# EAGLE board l3lfinal (EAGLE 6.5.0)
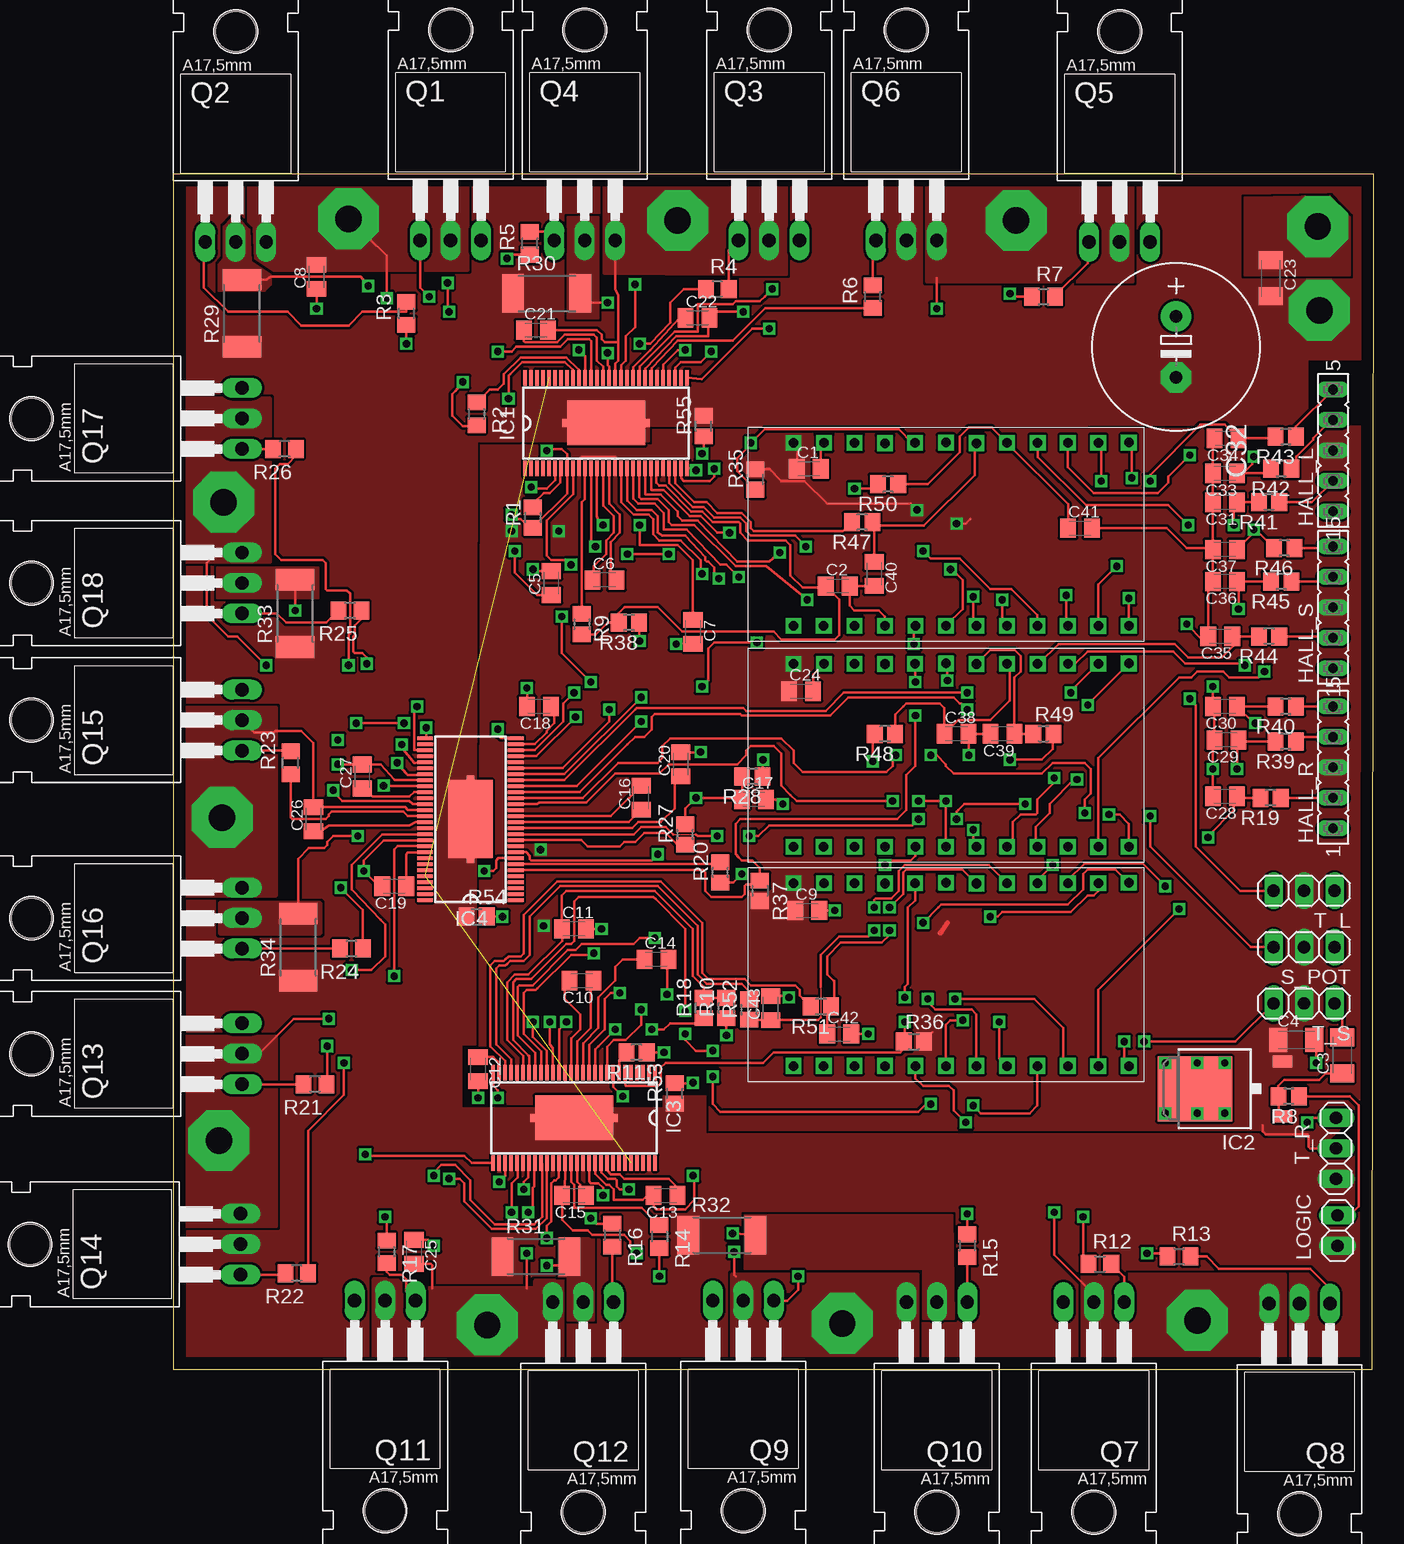
[diagram p3: board, top side]
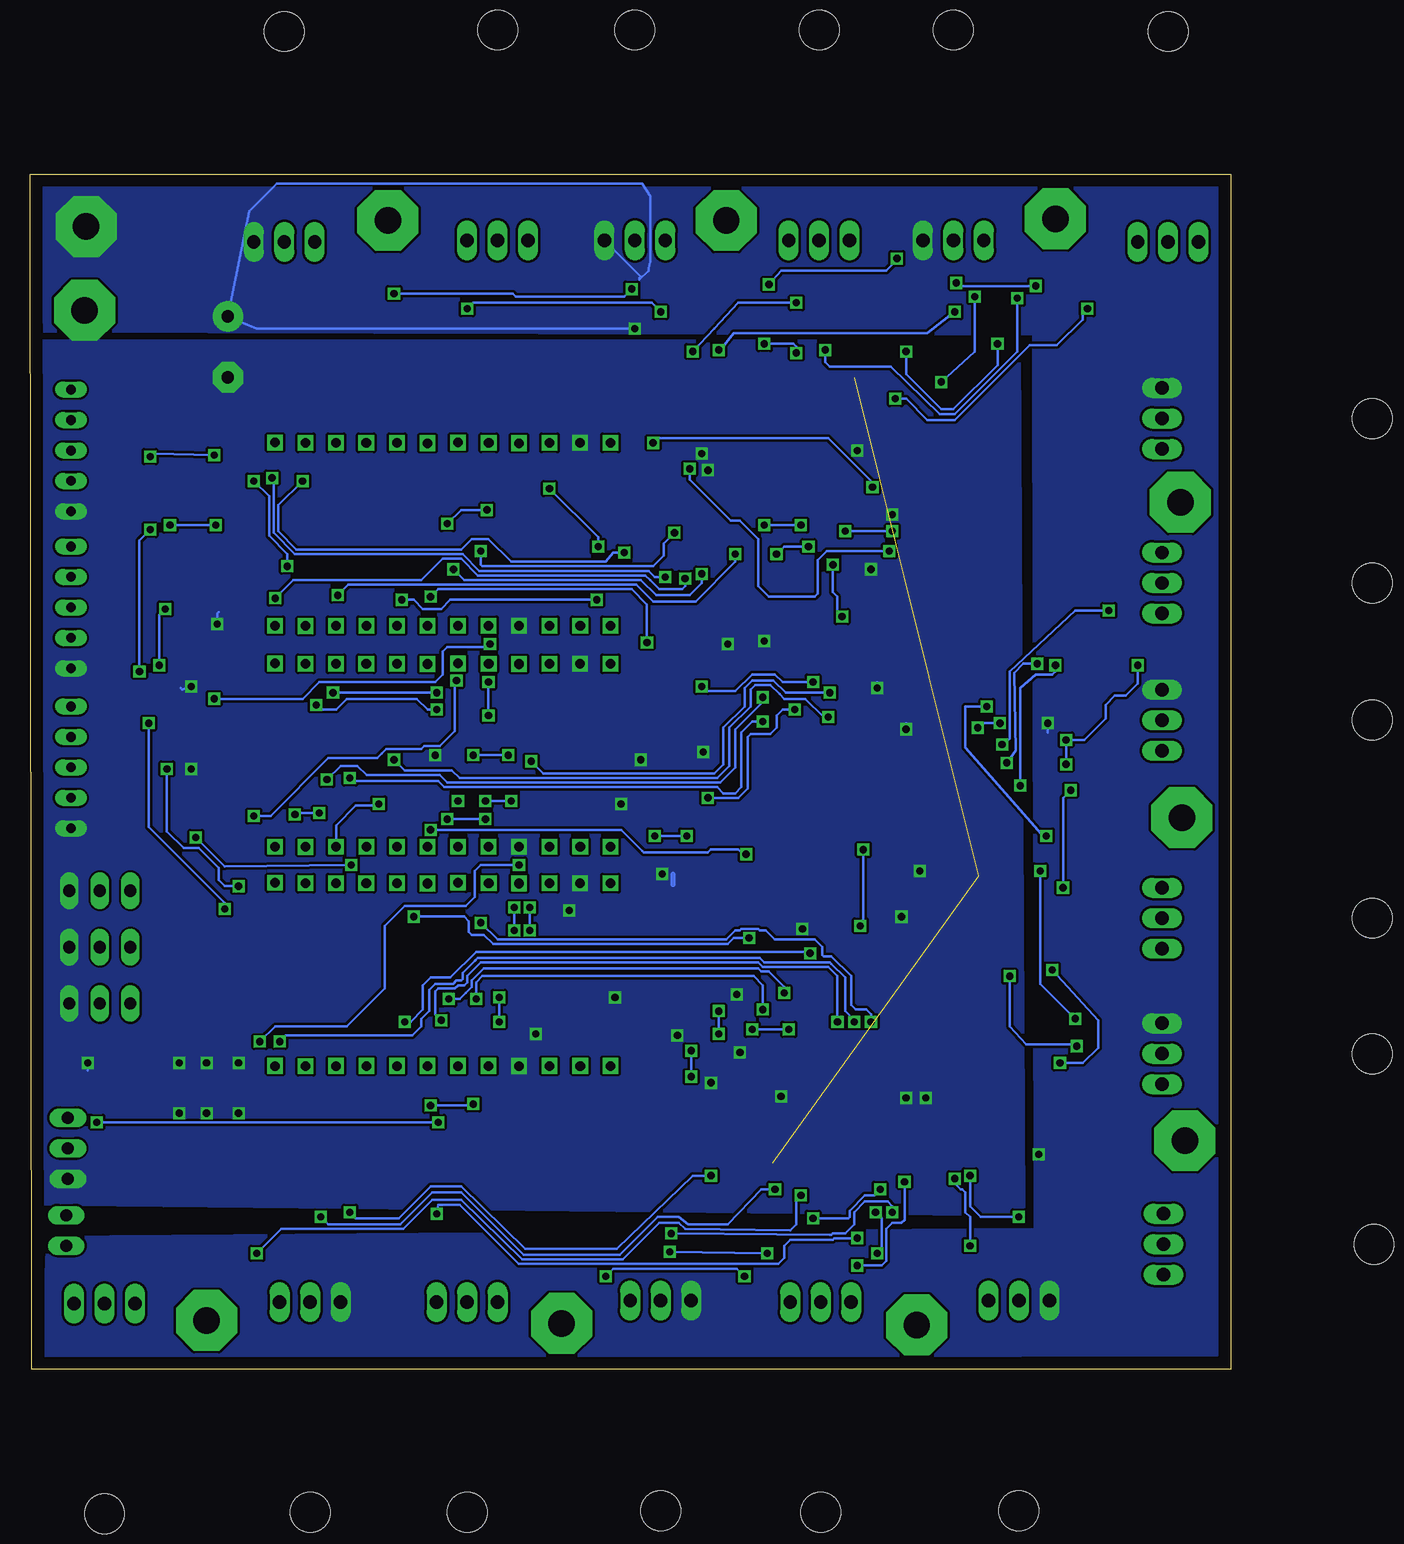
[diagram p4: board, bottom side, seen from below]

Size 100.06 x 99.62 mm. Coordinates in mm from the lower left corner, seen from the top.
Outline: 0,0 99.93,0 100.06,99.62 0,99.62 0,0
Copper layers (1*16): Top 0.035mm / dielectric 1.5mm / Bottom 0.035mm
Design rules "default *": minimum track width 8mil, minimum drill 4mil, track to track 8mil, track to pad 8mil, pad to pad 8mil, via to via 8mil, smd to smd 8mil, copper to edge 40mil, drill to drill 20mil, minimum pad ring 10mil, minimum via ring 8mil, stop-mask expansion 4mil, vias tented up to drill 0mil, thermal gap 10mil

## Footprints (pad centres in the part's own frame; a part is rotated, then mirrored left to right if it is on the bottom)
C0805K = smd 1.3 x 1.6: 1 -1,0; 2 1,0
C1206K = smd 1.5 x 2: 1 -1.5,0; 2 1.5,0
E5-13 = drill 1.016 pad 2.54: + -2.54,0 | drill 1.016 pad 2.54 octagon: - 2.54,0
12AWG_PAD = drill 2.2 pad 5.08 octagon: P$1 0,0
FE05-1 = drill 0.813 long: 1 -5.08,0; 2 -2.54,0; 3 0,0; 4 2.54,0; 5 5.08,0
TSSOP-56_3 = smd 1.3 x 0.3: 1 -3.775,6.75; 2 -3.775,6.25; 3 -3.775,5.75; 4 -3.775,5.25; 5 -3.775,4.75; 6 -3.775,4.25; 7 -3.775,3.75; 8 -3.775,3.25; 9 -3.775,2.75; 10 -3.775,2.25; 11 -3.775,1.75; 12 -3.775,1.25; 13 -3.775,0.75; 14 -3.775,0.25; 15 -3.775,-0.25; 16 -3.775,-0.75; 17 -3.775,-1.25; 18 -3.775,-1.75; 19 -3.775,-2.25; 20 -3.775,-2.75; 21 -3.775,-3.25; 22 -3.775,-3.75; 23 -3.775,-4.25; 24 -3.775,-4.75; 25 -3.775,-5.25; 26 -3.775,-5.75; 27 -3.775,-6.25; 28 -3.775,-6.75; 29 3.775,-6.75; 30 3.775,-6.25; 31 3.775,-5.75; 32 3.775,-5.25; 33 3.775,-4.75; 34 3.775,-4.25; 35 3.775,-3.75; 36 3.775,-3.25; 37 3.775,-2.75; 38 3.775,-2.25; 39 3.775,-1.75; 40 3.775,-1.25; 41 3.775,-0.75; 42 3.775,-0.25; 43 3.775,0.25; 44 3.775,0.75; 45 3.775,1.25; 46 3.775,1.75; 47 3.775,2.25; 48 3.775,2.75; 49 3.775,3.25; 50 3.775,3.75; 51 3.775,4.25; 52 3.775,4.75; 53 3.775,5.25; 54 3.775,5.75; 55 3.775,6.25; 56 3.775,6.75 | smd 3.7 x 6.5: 57 0,0 | smd 0.65 x 0.4: 58 0,3.45; 59 0,-3.45
TO252 = smd 1 x 1.6: 1 -2.28,-4.8; 2 2.28,-4.8 | smd 5.4 x 6.2: 3 0,2.5
1X02 = drill 1.016 long: 1 -1.27,0; 2 1.27,0
TO220 = drill 1.118 long: 1 -2.54,-6.35; 2 0,-6.35; 3 2.54,-6.35 | hole 3.302: 0,11.176
R0805 = smd 1.3 x 1.5: 1 -0.85,0; 2 0.85,0
R0805' = smd 1.3 x 1.5: 1 -0.95,0; 2 0.95,0
R2512 = smd 1.8 x 3.2: 1 -2.8,0; 2 2.8,0
1X03 = drill 1.016 long: 1 -2.54,0; 2 0,0; 3 2.54,0
ARDUINOPROMINI = drill 0.8 square: 2 1.27,19.05; 3 1.27,16.51; 4 1.27,13.97; 5 1.27,11.43; 6 1.27,8.89; 7 1.27,6.35; 8 1.245,3.81; 9 1.27,1.27; 10 16.535,1.27; 11 16.51,3.81; 12 16.51,6.35; 13 16.51,8.865; A0 16.51,11.43; A1 16.485,13.97; A2 16.535,16.51; A3 16.51,19.075; GND 1.27,21.59; GND3 16.51,26.67; RAW 16.51,29.21; RST 1.27,24.13; RST2 16.51,24.13; RXI 1.27,26.695; TXO 1.27,29.21; VCC1 16.485,21.59

## Placement (x,y rotation side)
C1  [C0805K]  52.96,75.06 0 top
C2  2.2u  [C0805K]  55.37,65.28 0 top
C3  [C1206K]  97.41,26.16 90 top
C4  [C1206K]  93.6,27.43 0 top
C5  1u  [C0805K]  31.5,65.53 90 top
C6  22n  [C0805K]  35.94,65.79 0 top
C7  2.2u  [C0805K]  43.31,61.47 270 top
C8  1u  [C0805K]  11.94,91.06 90 top
C9  [C0805K]  52.83,38.23 0 top
C10  22n  [C0805K]  34.04,32.38 180 top
C11  2.2u  [C0805K]  33.4,36.7 0 top
C12  1u  [C0805K]  25.4,25.02 270 top
C13  1u  [C0805K]  41.02,14.48 180 top
C14  2.2u  [C0805K]  40.26,34.16 0 top
C15  1u  [C0805K]  33.4,14.48 180 top
C16  22n  [C0805K]  38.99,47.62 90 top
C17  2.2u  [C0805K]  48.39,47.5 0 top
C18  1u  [C0805K]  30.48,55.24 180 top
C19  1u  [C0805K]  18.41,40.26 180 top
C20  2.2u  [C0805K]  42.29,50.42 90 top
C21  1u  [C0805K]  30.23,86.61 0 top
C22  1u  [C0805K]  43.69,87.63 0 top
C23  [C1206K]  91.44,90.93 270 top
C24  [C0805K]  52.32,56.52 0 top
C25  1u  [C0805K]  20.07,9.78 270 top
C26  1u  [C0805K]  11.68,45.85 90 top
C27  1u  [C0805K]  15.75,49.4 90 top
C28  [C0805K]  87.63,47.75 180 top
C29  [C0805K]  87.76,52.45 180 top
C30  [C0805K]  87.63,55.24 180 top
C31  [C0805K]  87.63,72.26 180 top
C32  1000u  [E5-13]  83.57,85.22 270 top
C33  [C0805K]  87.63,74.68 180 top
C34  [C0805K]  87.76,77.6 180 top
C35  [C0805K]  87.25,61.09 180 top
C36  [C0805K]  87.63,65.66 180 top
C37  [C0805K]  87.63,68.33 180 top
C38  1u  [C0805K]  65.28,52.96 0 top
C39  1u  [C0805K]  69.09,52.96 180 top
C40  1u  [C0805K]  58.42,66.29 270 top
C41  1u  [C0805K]  75.56,70.1 0 top
C42  1u  [C0805K]  55.5,27.94 0 top
C43  1u  [C0805K]  49.78,30.1 90 top
GND  12AWG_PAD  [12AWG_PAD]  95.5,88.27 0 top
HALL_L  [FE05-1]  96.65,76.58 90 top
HALL_R  [FE05-1]  96.65,50.16 90 top
HALL_S  [FE05-1]  96.65,63.5 90 top
IC1  DRV8302  [TSSOP-56_3]  36.07,78.87 90 top
IC2  7805DT  [TO252]  87.63,23.37 90 top
IC3  DRV8302  [TSSOP-56_3]  33.4,20.95 270 top
IC4  DRV8302  [TSSOP-56_3]  24.77,45.85 180 top
LOGIC  [1X02]  97.03,11.56 90 top
PHASE_AL  12AWG_PAD  [12AWG_PAD]  14.61,95.89 0 top
PHASE_AR  12AWG_PAD  [12AWG_PAD]  85.34,4.06 0 top
PHASE_AS  12AWG_PAD  [12AWG_PAD]  3.81,19.05 0 top
PHASE_BL  12AWG_PAD  [12AWG_PAD]  42.04,95.76 0 top
PHASE_BR  12AWG_PAD  [12AWG_PAD]  55.75,3.81 0 top
PHASE_BS  12AWG_PAD  [12AWG_PAD]  4.06,45.97 0 top
PHASE_CL  12AWG_PAD  [12AWG_PAD]  70.23,95.76 0 top
PHASE_CR  12AWG_PAD  [12AWG_PAD]  26.16,3.68 0 top
PHASE_CS  12AWG_PAD  [12AWG_PAD]  4.19,72.26 0 top
Q1  PSMN7R0-100PS  [TO220]  23.11,100.46 0 top
Q2  PSMN7R0-100PS  [TO220]  5.21,100.33 0 top
Q3  PSMN7R0-100PS  [TO220]  49.66,100.46 0 top
Q4  PSMN7R0-100PS  [TO220]  34.29,100.46 0 top
Q5  PSMN7R0-100PS  [TO220]  78.87,100.33 0 top
Q6  PSMN7R0-100PS  [TO220]  61.09,100.46 0 top
Q7  PSMN7R0-100PS  [TO220]  76.71,-0.76 180 top
Q8  PSMN7R0-100PS  [TO220]  93.85,-0.89 180 top
Q9  PSMN7R0-100PS  [TO220]  47.5,-0.64 180 top
Q10  PSMN7R0-100PS  [TO220]  63.63,-0.76 180 top
Q11  PSMN7R0-100PS  [TO220]  17.65,-0.64 180 top
Q12  PSMN7R0-100PS  [TO220]  34.16,-0.76 180 top
Q13  PSMN7R0-100PS  [TO220]  -0.64,26.29 90 top
Q14  PSMN7R0-100PS  [TO220]  -0.76,10.41 90 top
Q15  PSMN7R0-100PS  [TO220]  -0.64,54.1 90 top
Q16  PSMN7R0-100PS  [TO220]  -0.64,37.59 90 top
Q17  PSMN7R0-100PS  [TO220]  -0.64,79.25 90 top
Q18  PSMN7R0-100PS  [TO220]  -0.64,65.53 90 top
R1  0  [R0805]  29.97,70.99 90 top
R2  [R0805']  25.27,79.63 270 top
R3  [R0805']  19.43,88.01 90 top
R4  [R0805']  45.34,90.04 0 top
R5  [R0805']  29.72,93.85 90 top
R6  [R0805']  58.29,89.41 90 top
R7  [R0805']  72.52,89.41 0 top
R8  0  [R0805]  92.96,22.73 180 top
R9  [R0805]  34.04,62.1 270 top
R10  [R0805]  46.1,30.1 90 top
R11  0  [R0805]  38.61,26.42 180 top
R12  [R0805']  77.22,8.76 0 top
R13  [R0805']  83.82,9.4 0 top
R14  [R0805']  40.51,11.05 270 top
R15  [R0805']  66.17,10.29 270 top
R16  [R0805']  36.58,11.18 270 top
R17  [R0805']  17.78,9.78 270 top
R18  [R0805]  44.2,30.1 90 top
R19  [R0805]  91.44,47.62 180 top
R20  0  [R0805]  45.59,41.4 90 top
R21  [R0805']  11.81,23.75 180 top
R22  [R0805']  10.29,8 180 top
R23  [R0805']  9.78,50.55 90 top
R24  [R0805']  14.86,35.05 180 top
R25  [R0805']  14.73,63.25 180 top
R26  [R0805']  9.27,76.71 180 top
R27  [R0805]  42.67,44.58 90 top
R28  [R0805]  48.26,49.4 180 top
R29  [R2512]  5.71,88.01 90 top
R30  [R2512]  31.11,89.66 0 top
R31  1m  [R2512]  30.23,9.4 0 top
R32  1m  [R2512]  45.72,11.18 0 top
R33  [R2512]  10.16,62.99 90 top
R34  [R2512]  10.41,35.18 90 top
R35  10k  [R0805]  48.51,74.17 90 top
R36  10k  [R0805]  61.72,27.3 0 top
R37  10k  [R0805]  48.9,39.88 270 top
R38  [R0805]  37.97,62.23 180 top
R39  0  [R0805]  92.71,52.32 180 top
R40  0  [R0805]  92.71,55.24 180 top
R41  0  [R0805]  91.31,72.26 180 top
R42  0  [R0805]  92.33,75.06 180 top
R43  0  [R0805]  92.71,77.72 180 top
R44  0  [R0805]  91.31,61.09 180 top
R45  0  [R0805]  92.33,65.66 180 top
R46  0  [R0805]  92.58,68.45 180 top
R47  0  [R0805]  57.4,70.61 180 top
R48  0  [R0805]  59.31,52.96 180 top
R49  0  [R0805]  72.52,52.96 0 top
R50  0  [R0805]  59.56,73.79 180 top
R51  0  [R0805]  53.98,30.23 180 top
R52  0  [R0805]  48.01,29.97 90 top
R53  10k  [R0805]  41.78,22.99 90 top
R54  10k  [R0805]  25.27,37.72 0 top
R55  10k  [R0805]  44.2,78.61 90 top
S_POT  [1X03]  94.23,35.18 180 top
T_L  [1X03]  94.23,39.88 180 top
T_R  [1X03]  96.9,18.41 90 top
T_S  [1X03]  94.23,30.48 180 top
U$1  ARDUINOPROMINI  [ARDUINOPROMINI]  80.9,60.71 90 top
U$2  ARDUINOPROMINI  [ARDUINOPROMINI]  80.9,24 90 top
U$3  ARDUINOPROMINI  [ARDUINOPROMINI]  80.9,42.29 90 top
VDD  12AWG_PAD  [12AWG_PAD]  95.38,95.25 0 top

## Tracks (layer width: path | path; a pad name or v marks a point on that pad's centre or on a via)
+12V
  Top 0.203: R8.1 94.36,22.73 96.39,22.73 98.04,22.73 98.81,21.97 98.81,13.59 98.04,12.83 LOGIC.2
BST_BK  (2 unrouted)
GND  (via drill 0.6)
  Top 0.203: C14.2 41.15,34.27 v41.15,31.24 | C24.2 53.32,57.9 U$3.GND3 | v66.29,51.18 66.28,51.2 C38.2 C39.2 | C20.2 43.93,51.42 v43.94,51.44 | C37.2 C36.2 86.25,65.28 C35.2 86.63,60.71 85.85,60.71 v84.45,62.1 | C28.2 86.63,49.77 v86.61,50.04 86.63,49.8 86.63,52.32 C29.2 86.76,55.12 C30.2 86.63,56.63 v86.61,56.9 | C1.2 53.96,76.95 U$1.GND3 | C34.2 86.63,77.47 C33.2 C31.2 C37.2 | C41.2 82.8,70.1 84.45,68.45 86.5,68.45 C37.2 | C40.2 58.4,65.28 C2.2 56.37,63.64 56.77,63.25 58.8,63.25 59.31,62.74 U$1.GND | C18.2 29.48,56.75 v29.46,56.77 | IC4.28 27.29,52.6 27.05,52.83 v27.05,53.34 | IC4.8 27.1,42.6 26.92,42.42 26.92,41.78 26.67,41.53 v25.91,41.53 | C11.2 v35.69,36.7 | R54.2 v27.43,37.72 | IC3.28 26.65,23.64 27.05,23.24 v27.05,22.61 | C12.2 v25.4,22.61 | R20.1 46.65,40.55 v47.37,41.27 | C9.2 v55.12,38.23 | R11.1 v40.89,26.42 | R53.2 43.27,23.84 v43.31,23.88 | IC3.8 36.65,23.55 v37.47,22.73 | C43.2 51.2,31.1 v51.31,30.99 | C42.2 v57.91,27.94 | R10.1 v46.1,27.81 | v31.11,76.58 31.24,76.71 32.39,76.71 32.82,76.28 IC1.8 32.82,72.99 R1.1 29.68,70.14 28.96,70.87 28.57,70.87 v28.19,71.25 | R55.1 44.2,76.45 v44.07,76.33 | IC1.28 43.4,75.09 v43.56,74.93 | R28.1 49.11,50.76 v49.15,50.8 | C17.2 50.16,47.5 50.55,47.12 v50.8,47.12 | C5.2 30.11,66.53 v29.97,66.67 | R38.1 38.82,60.74 v38.86,60.71 | C7.2 41.93,60.47 v41.91,60.45 | IC2.3 85.13,21.55 v85.34,21.34 | C4.2 95.25,27.43 v95.25,25.53 | C3.2 97.41,29.84 T_S.1
  Bottom 0.203: v66.29,51.18 66.67,51.18 | v86.61,50.04 86.61,49.91 86.49,50.04 | v86.61,56.9 87.38,56.64 87.5,56.77 | v84.45,62.1 84.45,62.99 84.33,63.12 | v29.46,56.77 29.46,57.28 | v27.05,53.34 27.05,53.85 | v25.91,41.53 25.91,41.4 | 27.05,37.72 27.18,37.72 v27.43,37.72 | v27.05,22.61 27.43,22.35 | v55.12,38.23 55.5,38.23 | v43.31,23.88 43.56,23.88 | v37.47,22.73 37.72,22.73 | v49.15,50.8 49.15,51.05 | v50.8,47.12 51.18,47.12 | v28.19,71.25 28.19,71.63 | v41.91,60.45 41.53,60.45 | v95.25,25.53 95.25,24.89
  Bottom 0.406: 46.48,41.27 46.48,40.39
  other vias: 82.68,25.53 85.34,25.53 87.63,25.53 87.63,21.34 82.68,21.34
  pour Bottom (rank 2, no thermals): 17.65,85.6 99.95,85.6 99.82,78.61 99.95,78.61 100.33,13.84 17.27,12.95
  pour Top (rank 3, no thermals): 99.06,84.2 94.49,84.2 94.49,78.74 39.62,78.61 39.62,77.34 25.27,77.34 25.15,27.05 24,27.05 24,21.72 40.89,21.72 40.89,22.73 44.32,22.73 44.32,19.56 98.93,19.56 98.93,1.02 1.02,1.02 1.14,99.44 99.69,99.44
HALL_AL  (via drill 0.6)
  Top 0.203: U$1.13 72.03,76.05 76.07,72.01 82.93,72.01 v84.58,70.36 | v88.39,70.36 88.39,72.03 C31.1 R41.2
  Bottom 0.203: v84.58,70.36 v88.39,70.36
HALL_AR  (via drill 0.6)
  Top 0.203: U$2.13 72.03,40.79 v73.28,42.04 | v86.23,44.32 86.23,44.45 88.39,46.61 88.39,47.51 C28.1 88.76,47.62 R19.2
  Bottom 0.203: v73.28,42.04 83.82,41.91 v86.23,44.32
HALL_AS
  Top 0.203: U$3.13 72.14,58.8 73.79,60.45 83.44,60.45 84.58,59.31 87.38,59.31 88.39,60.33 88.39,60.94 C35.1 R44.2
HALL_BL  (via drill 0.6)
  Top 0.203: U$1.12 74.55,75.18 76.71,73.03 82.04,73.03 82.93,73.91 82.93,74.42 v84.71,76.2 | C33.1 89.15,74.68 | 89.15,74.68 91.61,74.68 R42.2 | v90.04,76.07 89.92,75.44 89.15,74.68
  Bottom 0.203: v84.71,76.2 89.79,76.33 v90.04,76.07
HALL_BR  (via drill 0.6)
  Top 0.203: U$2.12 74.55,40.77 75.95,42.16 80.77,42.16 v82.68,40.26 | v88.65,50.04 88.65,52.34 C29.1 88.88,52.32 R39.2
  Bottom 0.203: v88.65,50.04 88.65,44.83 87.25,43.43 85.98,43.43 84.33,41.78 84.33,40.77 83.82,40.26 v82.68,40.26
HALL_BS  (via drill 0.6)
  Top 0.203: U$3.12 75.18,58.8 76.2,59.82 83.31,59.82 84.33,58.8 89.15,58.8 v89.28,58.67 | v88.77,63.37 88.77,65.52 C36.1 R45.2
  Bottom 0.203: v89.28,58.67 89.28,62.87 v88.77,63.37
HALL_CL  (via drill 0.6)
  Top 0.203: U$1.8 77.09,65.41 v78.61,66.93 | v81.41,74.04 81.41,74.55 85.6,78.74 87.61,78.74 C34.1 91.73,77.6 R43.2
  Bottom 0.203: v78.61,66.93 78.61,67.94 80.14,69.47 80.14,72.77 v81.41,74.04
HALL_CR  (via drill 0.6)
  Top 0.203: 92.2,54.9 R40.2 C30.1 90.03,53.85 v90.17,53.85 | U$2.8 77.09,31.62 v83.82,38.35
  Bottom 0.203: v83.82,38.35 83.82,38.86 90.17,45.21 v90.17,53.85
HALL_CS  (via drill 0.6)
  Top 0.203: U$3.8 77.09,50.93 83.82,57.66 84.84,57.66 85.34,58.17 87.5,58.17 88.01,57.66 90.42,57.66 v90.93,58.17 | R46.2 90.21,69.98 v90.04,69.98 90.04,69.74 C37.1
  Bottom 0.203: v90.93,58.17 90.93,69.09 v90.04,69.98
N$1
  Top 0.203: IC1.47 33.78,82.55 33.78,83.31 32.77,84.33 28.96,84.33 27.56,82.93 27.56,82.17 27.05,81.66 26.36,81.66 R2.1
N$2  (via drill 0.6)
  Top 0.203: R4.1 42.55,90.04 41.4,88.9 41.4,87.25 39.75,85.47 v38.86,85.47 | v36.2,84.71 36.2,83.69 36.32,83.57 36.32,82.52 IC1.42
  Bottom 0.203: v38.86,85.47 36.45,85.47 36.2,85.22 v36.2,84.71
N$3  (via drill 0.6)
  Top 0.203: IC1.37 38.86,82.56 38.86,83.57 41.78,86.49 43.69,86.49 43.69,88.77 46.23,88.77 46.61,88.77 46.86,89.03 48.9,89.03 49.28,89.41 v49.91,90.04 | R7.1 69.98,89.41 v69.72,89.66
  Bottom 0.203: v49.91,90.04 50.55,89.41 57.28,89.41 59.56,89.41 59.82,89.66 v69.72,89.66
N$4  (via drill 0.6)
  Top 0.203: v19.43,85.47 R3.1 | IC1.45 34.82,85.7 34.67,85.85 32.89,85.85 32.26,85.22 28.57,85.22 28.19,84.84 v27.05,84.84
  Bottom 0.203: v19.43,85.47 19.43,83.69 23.11,80.01 24.13,80.01 27.05,82.93 27.05,84.2 v27.05,84.84
N$5
  Top 0.203: C13.1 42.02,15.13 41.28,15.88 37.59,15.88 37.21,16.26 36.45,16.26 36.2,16.51 36.2,17.14 IC3.48
N$6
  Top 0.203: IC2.1 92.11,21.4 R8.2 92.07,22.77 92.07,23.62 92.58,24.13 95.5,24.13 96.04,24.66 C3.1
N$7  (via drill 0.6)
  Top 0.203: R5.1 27.75,92.9 v27.81,92.58 | v38.48,90.42 38.48,86.87 37.72,86.11 37.72,84.07 37.34,83.69 37.34,82.53 IC1.40
  Bottom 0.203: v27.81,92.58 27.81,92.46 28.7,91.57 37.47,91.57 v38.48,90.42
N$8
  Top 0.203: R6.1 49.34,88.46 46.61,85.72 42.04,85.72 39.88,83.44 39.88,82.58 IC1.35
N$9
  Top 0.203: IC3.43 33.65,15.62 33.91,15.37 33.91,14.97 C15.1
N$10  (via drill 0.6)
  Top 0.203: IC1.17 37.32,72.28 38.35,71.25 39.62,71.25 40.01,70.87 40.01,69.6 40.51,69.09 42.29,69.09 43.94,67.44 43.94,66.42 v44.07,66.29 | v64.77,66.67 64.9,66.67 65.79,65.79 65.79,63.37 U$1.3
  Bottom 0.203: v44.07,66.29 44.07,65.53 45.09,64.52 47.88,64.52 49.15,65.79 51.69,65.79 63.88,65.79 v64.77,66.67
N$11  (via drill 0.6)
  Top 0.203: IC1.18 37.82,72.42 38.61,71.63 39.88,71.63 40.39,71.12 40.39,69.72 40.77,69.47 42.67,69.47 44.32,67.69 44.32,67.44 44.45,67.31 44.58,67.31 45.09,66.8 45.09,66.29 v45.47,65.91 | v79.63,64.26 U$1.9
  Bottom 0.203: v45.47,65.91 45.47,65.28 45.72,65.02 47.62,65.02 48.39,65.79 48.77,66.17 51.56,66.17 62.74,66.17 64.13,67.56 65.66,67.56 67.44,65.79 78.1,65.79 v79.63,64.26
N$12  (via drill 0.6)
  Top 0.203: IC1.20 38.82,72.69 38.99,72.52 40.39,72.52 41.28,71.63 41.28,70.61 41.53,70.36 43.43,70.36 46.86,66.93 49.4,66.93 v52.83,64.14 | v69.09,64.14 69.09,62.36 U$1.5
  Bottom 0.203: v52.83,64.14 65.02,64.14 65.79,63.37 67.31,63.37 68.07,64.14 v69.09,64.14
N$13  (via drill 0.6)
  Top 0.203: U$1.6 72.01,62.87 69.85,65.02 68.07,65.02 65.53,67.56 63.12,67.56 v62.48,68.2 | IC1.22 39.82,73.34 39.88,73.28 40.89,73.28 43.05,71.12 43.94,71.12 45.34,69.72 v46.36,69.72
  Bottom 0.203: v62.48,68.2 62.48,67.06 62.36,66.93 48.13,66.93 47.24,67.82 47.24,68.83 v46.36,69.72
N$14  (via drill 0.6)
  Top 0.203: IC1.19 38.32,72.55 38.73,72.14 40.13,72.14 40.89,71.37 40.89,69.98 42.8,69.98 45.59,67.06 46.1,67.06 v47.12,66.04 | v79.88,74.3 79.88,76.99 U$1.10
  Bottom 0.203: v79.88,74.3 79.76,74.17 79.76,69.72 77.98,67.94 64.01,67.94 62.61,66.55 51.31,66.55 48.51,66.55 48.01,66.04 v47.12,66.04
N$15  (via drill 0.6)
  Top 0.203: IC1.21 39.32,72.95 39.37,72.9 40.64,72.9 42.04,71.5 42.04,71.12 42.42,70.74 43.69,70.74 46.99,67.31 49.66,67.31 v50.55,68.07 | v77.34,74.04 77.34,76.96 U$1.11
  Bottom 0.203: v50.55,68.07 51.44,68.07 52.07,67.31 59.94,67.31 61.85,69.22 63.25,69.22 64.13,68.33 77.85,68.33 79.38,69.85 79.38,72.01 v77.34,74.04
N$16
  Top 0.203: R1.2 29.97,72.14 30.86,73.03 31.37,73.03 32.26,73.91 32.26,74.91 IC1.7
N$17
  Top 0.203: R7.2 73.47,89.47 76.2,92.2 76.2,93.85 Q5.1
N$18
  Top 0.203: R6.2 58.29,93.85 Q6.1
N$19
  Top 0.203: R5.2 30.93,94.8 Q4.1
N$20
  Top 0.203: R4.2 46.29,93.28 Q3.1
N$21
  Top 0.203: R3.2 19.43,88.14 15.75,88.14 14.61,87 10.67,87 9.53,88.14 4.57,88.14 2.54,90.17 2.54,93.85 Q2.1
N$22  (via drill 0.6)
  Top 0.203: Q1.1 20.57,90.17 v21.34,89.41 | v24.13,82.3 23.49,81.53 23.24,81.28 23.24,79.5 24.13,78.61 25.21,78.61 R2.2
  Bottom 0.203: v21.34,89.41 21.34,84.84 v24.13,82.3
N$23  (via drill 0.6)
  Top 0.203: v75.82,12.7 75.82,9.21 R12.1 | v37.97,14.99 37.21,14.99 36.96,15.24 36.96,15.75 36.83,15.88 36.2,15.88 35.65,16.42 IC3.47
  Bottom 0.203: v37.97,14.99 39.12,14.99 41.91,12.06 45.21,12.06 45.97,12.7 47.75,12.7 50.93,9.53 58.93,9.53 64.13,14.73 66.55,14.73 69.21,12.06 75.18,12.06 v75.82,12.7
N$24  (via drill 0.6)
  Top 0.203: C5.1 30.84,64.53 30.34,64.53 30.23,64.64 28.45,66.42 v28.45,68.2 | 42.29,74.94 IC1.27 42.32,74.27 42.55,74.04 44.7,74.04 45.09,74.42 v45.09,75.06
  Bottom 0.203: v28.45,68.2 33.66,68.2 34.42,67.44 34.42,64.64 34.67,64.39 38.48,64.39 39.37,65.28 39.37,69.22 40.89,70.74 41.66,70.74 45.09,74.17 v45.09,75.06
N$25  (via drill 0.6)
  Top 0.203: IC1.9 33.32,72.94 31.11,70.74 31.11,67.82 31.5,67.44 32.77,67.44 v33.15,67.06 | v66.67,64.39 66.67,62.23 U$1.4 | v48.64,60.58 45.09,60.58 44.58,60.07 44.58,57.4 v44.07,56.9 | v32.39,62.74 32.39,59.69 v34.8,57.28
  Bottom 0.203: v66.67,64.39 66.04,65.02 52.2,65.02 49.91,65.02 48.64,63.75 48.64,63.12 v48.64,60.58 | v44.07,56.9 43.69,56.52 41.28,56.52 39.88,57.91 37.97,57.91 37.34,57.28 35.94,57.28 v34.8,57.28 | v33.15,67.06 33.15,64.77 32.77,64.39 32.77,63.12 v32.39,62.74
N$26
  Top 0.203: IC1.23 40.26,74.91 40.26,73.91 40.51,73.66 41.02,73.66 43.18,71.5 44.07,71.5 44.96,70.61 47.12,70.61 47.24,70.48 47.24,69.72 47.88,69.09 51.05,69.09 51.44,68.71 51.44,66.17 52.45,65.15 54.25,65.15 C2.1 55.5,64.15 55.5,61.21 55.12,60.83 50.67,60.83 50.04,61.47 42.42,61.47 40.37,63.52 37.61,63.52 37.59,63.5 37.12,63.03 37.12,62.57 R38.2 36.2,62.23 35.22,61.25 R9.2
N$27
  Top 0.203: IC1.14 35.82,72 36.7,71.12 36.7,69.72 36.07,69.09 36.07,67.94 35.05,66.93 35.05,65.9 C6.1
N$28
  Top 0.203: IC1.15 36.32,72.14 37.21,71.25 37.21,69.72 36.45,68.96 36.45,66.28 C6.2
N$29  (via drill 0.6)
  Top 0.203: C8.1 v11.94,88.39 | v27.94,80.9 27.94,82.42 27.94,82.8 28.07,82.93 29.08,83.95 32.64,83.95 33.27,83.31 33.27,82.56 IC1.48
  Bottom 0.203: v11.94,88.39 12.32,88.27 12.32,87.5 14.48,85.34 16.76,85.34 22.99,79.12 25.27,79.12 27.05,80.9 v27.94,80.9
N$30  (via drill 0.6)
  Top 0.203: C7.1 43.31,67.44 42.04,68.71 38.86,68.71 v38.86,70.36 | v35.81,70.36 35.43,70.74 35.31,71.12 35.31,74.95 IC1.13
  Bottom 0.203: v38.86,70.36 v35.81,70.36
N$31
  Top 0.203: R9.1 34.04,72.26 34.29,72.52 34.29,74.94 IC1.11
N$32
  Top 0.203: 40.33,12 R14.1 39.05,13.46 33.4,13.46 33.4,15.37 33.15,15.62 33.15,16.13 33.15,16.8 IC3.42
N$33  (via drill 0.6)
  Top 0.203: R17.1 17.78,12.57 v17.65,12.7 | v21.72,16.13 21.72,16.38 22.35,17.02 23.49,17.02 24.77,15.75 24.77,14.1 26.8,12.06 27.81,12.06 30.1,12.06 30.73,12.7 30.73,17.1 IC3.37
  Bottom 0.203: v21.72,16.13 21.72,13.59 20.83,12.7 v17.65,12.7
N$34  (via drill 0.6)
  Top 0.203: v81.15,9.65 82.62,9.65 R13.1 | IC3.45 34.65,15.64 34.8,15.49 35.43,15.49 35.81,15.11 v35.81,14.48
  Bottom 0.203: v35.81,14.48 35.81,14.35 36.2,13.97 36.2,12.06 36.7,11.56 45.47,11.68 45.97,12.19 47.62,12.19 50.67,9.14 59.05,9.14 64.13,14.1 66.55,14.1 68.96,11.68 79.12,11.68 v81.15,9.65
N$35  (via drill 0.6)
  Top 0.203: IC3.40 32.13,16.8 32.13,16 31.88,15.75 31.75,15.75 31.5,15.49 31.5,12.32 31.11,11.94 v31.11,10.92 | v66.17,12.95 R15.1
  Bottom 0.203: v31.11,10.92 33.02,10.92 33.15,10.79 36.45,10.79 36.7,10.79 37.21,10.29 37.21,9.27 37.72,8.76 44.32,8.76 59.31,8.76 64.26,13.72 66.04,13.72 v66.17,12.95
N$36  (via drill 0.6)
  Top 0.203: R16.1 35.25,12.13 v34.8,12.57 | v29.21,14.99 29.21,15.62 29.59,16 29.59,16.74 IC3.35
  Bottom 0.203: v34.8,12.57 32.39,12.57 31.88,12.57 31.75,12.7 31.75,13.21 30.48,14.48 30.23,14.48 29.72,14.48 v29.21,14.99
N$37  (via drill 0.6)
  Top 0.203: IC3.17 32.15,28.34 v32.77,28.96 | v65.79,29.08 64.77,29.08 64.39,28.7 U$2.3
  Bottom 0.203: v32.77,28.96 32.77,31.5 32.77,32.38 32.77,32.77 33.53,33.53 38.99,33.53 39.37,33.91 62.48,33.91 63.63,32.77 63.63,32.26 63.88,32 64.39,32 64.64,31.75 66.04,31.75 66.29,31.5 66.29,29.59 v65.79,29.08
N$38  (via drill 0.6)
  Top 0.203: v79.25,27.3 79.25,25.65 U$2.9 | IC3.18 31.62,24.76 31.62,26.42 31.62,26.67 31.62,26.8 31.37,27.05 v31.37,28.96
  Bottom 0.203: v79.25,27.3 78.74,27.81 68.2,27.81 67.44,28.57 67.44,29.21 66.8,29.84 66.8,31.62 66.29,32.13 64.77,32.13 64.52,32.38 64.13,32.38 64.01,32.51 64.01,33.02 62.99,34.04 | 62.74,34.29 62.93,34.1 | 62.93,34.1 62.99,34.04 | v31.37,28.96 31.37,29.08 32.13,29.84 32.13,32.64 33.27,33.78 33.4,33.91 38.86,33.91 39.24,34.29 62.74,34.29 | 62.74,34.29 62.93,34.1 | 62.93,34.1 62.99,34.04 | 62.74,34.29 62.93,34.1
N$39  (via drill 0.6)
  Top 0.203: v68.83,28.96 68.83,25.91 U$2.5 | v35.05,34.67 34.93,34.54 33.15,34.54 30.35,31.75 30.23,31.62 29.46,31.62 29.21,31.37 29.21,30.23 29.21,27.94 30.65,26.5 IC3.20
  Bottom 0.203: v68.83,28.96 68.33,28.96 67.31,29.97 67.31,32 66.67,32.64 65.02,32.64 62.87,34.8 35.18,34.8 v35.05,34.67
N$40  (via drill 0.6)
  Top 0.203: IC3.22 29.65,26.1 29.59,26.16 28.32,27.43 28.32,27.56 28.32,30.99 28.32,32.26 28.57,32.51 29.84,32.51 32.77,35.43 33.15,35.43 33.4,35.69 33.4,36.07 33.4,38.99 33.78,39.37 40.01,39.37 | U$2.6 72.01,21.97 71.37,21.34 67.31,21.34 v66.67,21.97 | v63.12,22.1 62.74,22.1 62.1,21.46 45.59,21.46 44.96,22.1 v44.96,24.38 | v42.67,29.84 42.67,36.7 40.2,39.18 | 40.2,39.18 40.01,39.37 | v42.67,27.94 42.67,27.43 43.56,26.54 v44.96,26.54 | 40.01,39.37 40.2,39.18
  Bottom 0.203: v66.67,21.97 63.25,21.97 v63.12,22.1 | v44.96,24.38 v44.96,26.54 | v42.67,27.94 42.67,29.72 v42.67,29.84
N$41  (via drill 0.6)
  Top 0.203: IC4.20 33.61,48.6 v38.99,53.98 | v73.41,49.28 73.41,48.9 72.01,47.5 72.01,46.35 71.88,46.23 70.61,46.23 69.98,45.59 69.98,44.07 U$3.5
  Bottom 0.203: v38.99,53.98 39.24,53.98 39.88,53.98 40.77,53.09 40.77,52.45 40.77,48.51 41.28,48.01 42.29,48.01 42.8,48.51 47.37,48.51 65.53,48.51 66.04,49.02 73.15,49.02 v73.41,49.28
N$42  (via drill 0.6)
  Top 0.203: IC3.21 30.15,26.36 28.7,27.81 28.7,30.61 28.7,31.88 28.83,32 29.97,32 32.89,34.92 33.53,34.92 34.04,35.43 38.35,35.43 38.86,35.94 v40.13,35.94 | v68.07,37.72 68.71,37.72 69.09,38.1 74.8,38.1 76.2,39.5 76.71,39.5 77.09,39.88 U$2.11
  Bottom 0.203: v40.13,35.94 41.4,35.94 41.91,35.43 61.47,35.43 62.23,36.2 63.25,36.2 63.5,36.45 63.5,37.34 63.88,37.72 v68.07,37.72
N$43
  Top 0.203: R11.2 37.76,26.33 37.21,25.78 37.15,25.72 IC3.7
N$44
  Top 0.203: R17.2 17.78,8.13 18.03,7.87 19.05,7.87 19.43,7.49 19.43,6.48 Q11.1
N$45
  Top 0.203: R16.2 36.58,5.71 Q12.1
N$46
  Top 0.203: R15.2 Q10.1
N$47  (via drill 0.6)
  Top 0.203: R14.2 v40.51,7.75 | v52.07,7.75 52.07,7.37 52.07,6.6 51.18,5.71 Q9.1
  Bottom 0.203: v40.51,7.75 41.15,8.38 51.44,8.38 v52.07,7.75
N$48
  Top 0.203: R13.2 86.11,9.4 87.12,8.38 94.74,8.38 96.39,6.73 Q8.1
N$49
  Top 0.203: Q7.1 79.25,7.68 R12.2
N$50
  Top 0.203: C12.1 26.69,26.02 27.05,25.65 27.15,25.55 IC3.27
N$51  (via drill 0.6)
  Top 0.203: IC3.9 36.15,26.88 36.7,27.43 37.59,27.43 37.72,27.43 38.99,28.7 v38.99,29.97 | v62.87,30.86 62.87,30.61 63.5,29.97 66.55,29.97 66.93,29.59 U$2.4
  Bottom 0.203: v38.99,29.97 38.99,31.88 38.99,32 39.75,32.77 62.36,32.77 62.87,32.26 v62.87,30.86
N$52
  Top 0.203: IC3.23 29.15,26.09 27.81,27.43 27.81,32.26 28.45,32.89 28.57,32.89 29.59,32.89 32.4,35.7 C11.1 32.39,36.72 32.39,39.5 32.77,39.88 40.13,39.88 43.31,36.7 43.31,32.77 44.2,31.88 R18.2 | 44.07,31.08 R18.2 | R10.2 R18.2
N$53
  Top 0.203: IC3.14 33.65,27.3 34.8,28.45 34.8,32.24 C10.1
N$54
  Top 0.203: IC3.15 33.15,27.56 33.91,28.32 33.91,29.59 32.64,30.86 32.64,32.37 C10.2
N$55  (via drill 0.6)
  Top 0.203: v22.99,15.88 23.88,15.88 24.26,15.49 24.26,13.97 26.54,11.68 27.56,11.68 30.23,11.68 31.11,12.57 31.11,17.14 IC3.38 | C25.1 21.22,10.78 v21.72,10.29
  Bottom 0.203: v22.99,15.88 22.99,15.49 22.48,14.99 22.35,14.99 22.1,14.73 22.1,13.08 21.72,12.7 v21.72,10.29
N$56
  Top 0.203: IC3.13 34.15,27.17 35.43,28.45 35.43,30.99 36.83,32.38 36.83,33.53 37.47,34.16 C14.1 39.24,34.15
N$57  (via drill 0.6)
  Top 0.203: v36.83,28.32 35.41,26.9 35.15,26.64 IC3.11 | v39.88,28.32 40.89,28.32 41.4,28.83 43.78,28.83 R18.1
  Bottom 0.203: v36.83,28.32 v39.88,28.32
N$58
  Top 0.203: IC4.48 20.95,43.05 19.56,43.05 19.41,42.91 C19.1
N$59  (via drill 0.6)
  Top 0.203: v12.83,26.92 12.83,23.82 R21.1 | IC4.47 18.7,43.6 18.41,43.31 v18.41,32.77
  Bottom 0.203: v18.41,32.77 18.41,28.57 17.02,27.05 12.95,27.05 v12.83,26.92
N$60
  Top 0.203: R23.1 9.78,45.97 9.91,45.85 12.7,45.85 12.95,46.1 12.95,46.23 13.21,46.48 19.18,46.48 19.56,46.1 19.81,46.1 IC4.42
N$61  (via drill 0.6)
  Top 0.203: R26.1 10.22,76.13 9.53,75.44 8.89,75.44 8.51,75.06 8.51,67.94 9.02,67.44 12.45,67.44 12.7,67.18 12.7,65.02 12.83,64.9 14.48,64.9 14.73,64.64 14.73,61.59 14.73,61.34 14.61,61.21 v14.61,58.67 | IC4.37 17.57,48.6 v17.53,48.64
  Bottom 0.203: v17.53,48.64 17.53,56.77 16.26,57.91 14.86,57.91 14.61,58.17 v14.61,58.67
N$62  (via drill 0.6)
  Top 0.203: R22.1 11.24,19.87 14.22,22.86 v14.22,25.53 | IC4.45 20.76,44.58 17.4,44.58 14.86,42.04 14.86,40.01 17.27,37.47 17.65,37.08 17.65,34.42 16.51,33.27 v14.86,33.27
  Bottom 0.203: v14.22,25.53 12.32,25.53 11.05,26.8 11.05,29.08 v14.86,33.27
N$63  (via drill 0.6)
  Top 0.203: R24.1 15.81,38.29 v13.97,40.13 | v13.34,48.26 13.34,48.13 14.1,47.37 19.68,47.37 19.94,47.12 20.32,47.12 20.97,47.12 IC4.40
  Bottom 0.203: v13.97,40.13 13.97,47.62 v13.34,48.26
N$64  (via drill 0.6)
  Top 0.203: v18.67,50.55 19.43,49.66 | 19.43,49.66 19.41,49.66 | R25.1 15.68,62.55 15.11,61.98 15.11,61.21 14.99,61.09 14.99,59.82 15.11,59.69 15.75,59.69 16.13,59.31 v16.13,58.8 | 19.43,49.66 19.56,49.53 20.92,49.53 IC4.35
  Bottom 0.203: v16.13,58.8 17.27,58.8 18.03,58.04 17.91,51.56 v18.67,50.55
N$65  (via drill 0.6)
  Top 0.203: IC4.17 28.56,47.12 30.35,47.12 30.48,47.24 34.42,47.24 36.83,49.66 37.97,49.66 40.51,49.66 41.28,50.42 45.09,50.42 46.99,50.42 47.75,51.18 47.75,51.56 48.13,51.94 50.04,51.94 50.67,51.31 50.67,48.64 51.44,47.88 51.94,47.37 53.09,47.37 54.48,47.37 | v62.1,47.37 63.75,47.37 v64.39,47.37 U$3.3 | 54.23,47.37 54.48,47.37 | 54.48,47.37 v59.94,47.37
  Bottom 0.203: v59.94,47.37 v62.1,47.37
N$66  (via drill 0.6)
  Top 0.203: IC4.18 34.14,47.6 37.08,50.55 40.39,50.55 40.77,50.93 40.77,51.94 41.4,52.58 50.67,52.58 51.69,51.56 51.69,50.55 52.45,49.78 59.44,49.78 59.94,50.29 59.94,50.93 v60.2,51.18 | v63.12,51.18 63.63,51.18 64.39,50.42 64.39,50.29 65.02,49.66 72.39,49.66 73.28,50.55 75.95,50.55 76.45,50.04 76.45,48.01 75.95,47.5 v75.95,46.35 | v77.98,46.23 78.87,46.23 79.63,45.47 U$3.9
  Bottom 0.203: v60.2,51.18 v63.12,51.18 | v75.95,46.35 77.85,46.35 v77.98,46.23
N$67
  Top 0.203: R41.1 94.87,72.26 HALL_L.2
N$68  (via drill 0.6)
  Top 0.203: IC4.22 32.58,49.6 v38.99,56.01 | v75.31,49.15 75.06,49.15 73.02,47.12 73.02,46.35 71.88,45.21 71.88,43.69 U$3.6
  Bottom 0.203: v38.99,56.01 38.99,55.63 41.28,53.34 41.28,50.16 42.55,48.9 47.88,48.9 65.28,48.9 65.91,49.53 72.01,49.53 72.77,50.29 74.17,50.29 v75.31,49.15
N$69  (via drill 0.6)
  Top 0.203: IC4.19 33.87,48.1 37.85,52.07 38.48,52.7 39.24,52.7 39.88,53.34 39.88,54.36 40.13,54.61 47.24,54.61 47.37,54.48 54.74,54.48 56.26,56.01 65.02,56.01 65.53,55.5 65.66,55.5 v66.17,54.99 | U$3.10 76.2,55.4 v76.2,55.37
  Bottom 0.203: v66.17,54.99 66.93,54.99 67.82,55.88 73.66,55.88 74.55,54.99 75.82,54.99 v76.2,55.37
N$70  (via drill 0.6)
  Top 0.203: IC4.21 32.59,49.1 38.48,54.99 38.61,55.12 47.5,55.12 47.75,54.86 54.36,54.86 55.88,56.39 56.01,56.39 v66.17,56.39 | v74.8,56.39 74.8,56.52 U$3.11
  Bottom 0.203: v66.17,56.39 v74.8,56.39
N$71
  Top 0.203: IC4.7 45.44,42.1 R20.2
N$72
  Top 0.203: Q17.1 R26.2
N$73
  Top 0.203: Q18.1 8.64,62.99 9.4,62.23 12.77,62.23 R25.2
N$74
  Top 0.203: Q16.1 R24.2
N$75
  Top 0.203: Q15.1 9.71,51.56 R23.2
N$76
  Top 0.203: Q14.1 9.21,7.87 R22.2
N$77
  Top 0.203: Q13.1 R21.2
N$78
  Top 0.203: IC4.27 30.13,52.1 31.11,53.09 31.11,53.21 31.75,53.85 31.75,54.98 C18.1
N$79  (via drill 0.6)
  Top 0.203: v66.67,44.96 66.67,43.81 U$3.4 | IC4.9 29.42,43.1 29.72,42.8 29.72,42.55 29.84,42.42 39.88,42.42 v40.39,42.93
  Bottom 0.203: v66.67,44.96 65.41,44.96 50.8,44.96 49.02,43.18 48.9,43.05 43.56,43.05 43.31,43.31 41.02,43.31 40.64,42.93 v40.39,42.93
N$80  (via drill 0.6)
  Top 0.203: R27.2 42.67,46.74 v43.56,47.62 46.1,47.62 47.26,47.62 C17.1 47.41,47.52 R28.2 | IC4.23 32.44,50.1 36.32,53.98 v36.32,54.99
  Bottom 0.203: v43.56,47.62 41.02,47.62 40.26,48.39 40.26,52.7 40.01,52.96 38.35,52.96 37.85,53.47 37.85,54.48 37.34,54.99 v36.32,54.99
N$81
  Top 0.203: IC4.14 37.96,45.6 C16.1
N$82
  Top 0.203: IC4.15 36.45,46.1 37.97,47.62 37.99,47.62 C16.2
N$83
  Top 0.203: C26.1 12.34,44.85 12.95,45.34 19.68,45.34 20.19,45.59 IC4.43
N$84
  Top 0.203: C20.1 41.78,48.91 41.78,46.74 40.64,45.59 38.73,45.59 38.24,45.1 IC4.13
N$85
  Top 0.203: 42.43,44.1 R27.1 | IC4.11 34.01,44.1 34.54,43.56 37.21,43.56 37.59,43.94 38.48,43.94 39.24,44.7 41.02,44.7 41.91,43.81 42.58,43.81 R27.1 | 42.46,43.94 R27.1
N$86
  Top 0.203: C27.1 15.99,48.4 16.64,47.75 19.68,47.75 20.07,48.13 20.95,48.13 IC4.38
N$87  (via drill 0.6)
  Top 0.203: IC3.12 34.65,26.9 34.65,27.03 35.94,28.32 35.94,30.86 36.45,31.37 v37.21,31.37 | v65.15,30.86 71.75,30.86 74.17,28.45 74.17,25.65 U$2.7
  Bottom 0.203: v37.21,31.37 37.21,31.88 38.48,33.15 38.73,33.15 39.12,33.15 39.37,33.4 62.23,33.4 63.25,32.38 63.25,31.88 63.75,31.37 64.26,30.86 v65.15,30.86
N$88
  Top 0.203: IC1.43 35.81,82.52 35.81,83.57 35.31,84.07 35.31,85.98 35.05,86.23 32.77,86.23 32.64,86.23 32,85.6 29.34,85.6 29.23,85.71 C21.1
N$89
  Top 0.203: IC1.38 38.32,83.53 39.75,84.96 42.18,87.63 C22.1
N$90  (via drill 0.6)
  Top 0.203: IC1.12 34.82,68.94 v35.18,68.58 | v37.85,67.94 v41.28,67.94 | v74.42,64.52 74.42,62.1 U$1.7
  Bottom 0.203: v41.28,67.94 41.28,67.31 44.58,64.01 48.13,64.01 49.53,65.41 51.94,65.41 73.53,65.41 v74.42,64.52 | v35.18,68.58 37.21,68.58 v37.85,67.94
N$92  (via drill 0.6)
  Top 0.203: IC1.6 31.82,74.11 31.11,73.41 29.97,73.41 v29.84,73.53 | R35.1 46.99,74.84 46.99,75.95 48.13,77.09 v48.13,77.22 49.28,78.36 60.45,78.36 61.6,77.22 U$1.A3
  Bottom 0.203: v29.84,73.53 29.84,73.91 33.53,77.6 47.75,77.6 v48.13,77.22
N$93  (via drill 0.6)
  Top 0.203: v61.85,57.28 61.85,58.78 U$3.A3 | v61.85,54.48 61.85,50.29 61.09,49.53 61.09,46.61 60.33,45.85 51.31,45.85 47.24,45.85 46.86,45.47 46.86,42.93 47.12,42.67 47.37,42.42 48.26,42.42 48.9,41.78 R37.1 48.55,40.39 47.75,40.39 47.62,40.26 47.62,39.62 47.37,39.37 44.83,39.37 44.32,39.88 44.32,41.4 44.13,41.6 40.45,41.6 IC4.6
  Bottom 0.203: v61.85,57.28 v61.85,54.48
N$94  (via drill 0.6)
  Top 0.203: U$2.A3 61.82,39.09 61.21,38.48 61.21,37.64 61.21,36.45 61.21,32.13 60.96,31.88 v60.96,30.99 | IC3.6 37.65,23.69 37.72,23.62 40.39,23.62 40.64,23.88 40.64,25.15 41.02,25.53 49.15,25.53 50.04,26.42 60.07,26.42 60.58,26.42 60.83,26.67 60.83,27.27 R36.1 | R36.1 60.87,27.22 60.83,27.18 | v60.96,28.96 60.96,27.39 R36.1
  Bottom 0.203: v60.96,30.99 v60.96,28.96
N$95  (via drill 0.6)
  Top 0.203: v62.48,37.21 63.75,38.48 64.01,38.73 65.02,38.73 74.55,38.73 75.82,40.01 75.82,41.27 76.2,41.66 78.51,41.66 U$2.10 | IC3.19 31.11,24.77 31.11,26.42 31.11,26.54 29.97,27.69 v29.97,28.96
  Bottom 0.203: v29.97,28.96 29.97,29.59 30.35,29.97 31.24,29.97 31.62,30.35 31.62,32.77 33.27,34.42 33.91,34.42 34.04,34.54 34.04,35.18 34.67,35.81 37.97,35.81 38.73,36.58 39.24,36.58 39.37,36.7 40.77,36.7 40.89,36.58 41.28,36.58 42.04,35.81 61.09,35.81 v62.48,37.21
N$96
  Top 0.203: HALL_L.4 96.52,79.12 95,77.6 95,77.47 93.6,76.07 93.6,74.97 R42.1
N$97
  Top 0.203: R43.1 93.56,78.57 HALL_L.5
N$98
  Top 0.203: HALL_R.2 R19.1
N$99
  Top 0.203: HALL_R.4 93.94,52.7 R39.1
N$100
  Top 0.203: HALL_R.5 R40.1
N$101
  Top 0.203: R44.1 96.52,61.09 HALL_S.2
N$102
  Top 0.203: R45.1 96.27,65.66 HALL_S.4
N$103
  Top 0.203: R46.1 96.52,68.45 HALL_S.5
N$105  (via drill 0.6)
  Top 0.102: 41.66,44.58 43.56,44.58
  Top 0.203: IC4.12 28.65,44.58 38.35,44.58 38.99,45.21 41.02,45.21 41.66,44.58 | v70.99,47.12 66.04,47.12 65.91,47.12 65.41,46.61 65.28,46.48 v65.28,45.85 | v45.34,44.45 43.69,44.45 43.56,44.58 | v48.01,44.45 48.77,44.45 49.66,45.34 61.6,45.34 v62.1,45.85
  Bottom 0.203: U$3.7 74.55,45.34 72.9,46.99 71.25,46.99 v70.99,47.12 | v48.01,44.45 v45.34,44.45 | v62.1,45.85 v65.28,45.85
N$106  (via drill 0.6)
  Top 0.203: IC4.26 30.13,51.6 32.51,53.98 32.51,55.5 v33.4,56.39 | v58.29,50.67 58.29,52.79 R48.2
  Bottom 0.203: v33.4,56.39 37.08,56.39 38.1,57.4 39.88,57.4 40.51,56.77 40.51,55.24 42.29,53.47 42.29,50.42 43.05,49.66 49.66,49.66 55.37,49.66 57.28,49.66 v58.29,50.67
N$107  (via drill 0.6)
  Top 0.203: IC4.25 30.27,51.1 v33.53,54.36 | v69.72,50.8 72.39,50.8 73.28,51.69 73.28,52.87 R49.2
  Bottom 0.203: v33.53,54.36 33.91,54.36 35.43,55.88 37.21,55.88 37.59,56.26 38.35,57.02 39.62,57.02 40.01,56.64 40.01,55.24 41.78,53.47 41.78,50.29 42.8,49.28 48.26,49.28 58.29,49.28 63.25,49.28 64.26,49.28 64.9,49.91 65.79,49.91 68.83,49.91 v69.72,50.8
N$110
  Top 0.203: IC1.26 41.82,73.88 43.43,72.26 44.45,72.26 45.34,71.37 47.37,71.37 48.13,70.61 48.13,70.1 48.39,69.85 55.79,69.85 R47.2
N$111  (via drill 0.6)
  Top 0.203: IC1.25 41.32,73.87 43.31,71.88 44.2,71.88 45.09,70.99 47.24,70.99 47.75,70.48 47.75,69.85 48.13,69.47 51.82,69.47 v52.71,68.58 | v56.77,73.41 58.33,73.41 R50.2
  Bottom 0.203: v52.71,68.58 52.71,69.34 v56.77,73.41
N$112
  Top 0.203: IC3.26 27.65,25.69 26.42,26.92 26.42,33.66 26.8,34.04 27.56,34.04 27.69,34.16 27.94,34.42 28.07,34.42 28.96,34.42 29.21,34.67 29.21,37.85 32,40.64 40.64,40.64 44.07,37.21 44.07,33.02 44.58,32.51 47.62,32.51 48.13,32 51.82,32 52.2,31.62 52.2,31.15 52.45,30.9 R51.2
N$113
  Top 0.203: IC3.25 28.15,25.82 26.92,27.05 26.92,32.77 26.92,33.4 27.18,33.66 27.69,33.66 27.81,33.78 28.07,34.04 29.21,34.04 29.72,34.54 29.72,37.72 32.26,40.26 40.39,40.26 43.69,36.96 43.69,32.89 44.45,32.13 47.37,32.13 48.01,31.5 R52.2
PHASE_AL  (via drill 0.6)
  Top 0.203: v17.78,89.28 17.78,92.84 PHASE_AL.P$1 | IC1.46 34.32,84.43 v33.78,84.96
  Bottom 0.203: v33.78,84.96 33.78,83.95 33.4,83.57 28.32,83.57 24.26,79.63 22.99,79.63 17.78,84.84 v17.78,89.28
  pour Top (rank 2, no thermals): 6.35,91.69 24.51,91.69 24.51,99.69 6.35,99.57
PHASE_AR  (via drill 0.6)
  Top 0.203: v43.31,16.13 43.43,16 43.43,14.1 42.67,13.34 40.26,13.34 40.02,13.57 C13.2 39.5,14.48 39.12,14.1 36.7,14.1 36.7,14.99 36.32,15.37 36.07,15.37 35.15,16.28 IC3.46 | v73.41,13.08 73.41,9.53 76.45,6.48 76.45,5.97 Q7.2
  Bottom 0.203: v43.31,16.13 44.83,16.13 51.18,10.03 58.8,10.03 64.13,15.24 66.67,15.24 69.34,12.57 72.9,12.57 v73.41,13.08
  pour Top (no thermals): 75.82,7.87 92.58,7.87 92.58,0.25 75.82,0.25
PHASE_AS  (via drill 0.6)
  Top 0.203: IC4.46 20.96,44.07 17.53,44.07 15.88,42.42 v15.88,41.53 17.14,40.26 C19.2 | v12.95,29.21 10.03,29.21 7.24,26.42 5.97,26.42 Q13.2
  Bottom 0.203: v15.88,41.53 15.88,32.13 v12.95,29.21
  pour Top (no thermals): 0.51,27.69 8.51,27.69 8.51,11.94 0.64,11.94
PHASE_BL
  Top 0.203: Q4.3 36.83,90.04 37.08,89.53 37.08,86.87 37.08,85.6 | IC1.41 36.83,82.53 36.83,83.82 37.08,84.07 37.08,85.6 | C21.2 35.31,86.61 35.69,86.23 35.69,85.85 35.94,85.6 36.45,85.6 37.08,85.6
  pour Top (no thermals): 35.94,99.82 35.94,91.44 51.05,91.31 51.05,99.69
PHASE_BR  (via drill 0.6)
  Top 0.203: v46.74,9.78 46.74,8.64 46.74,7.87 46.86,7.75 | IC3.41 32.66,16.8 32.64,14.73 32.4,14.49 C15.2 32.4,12.43 33.27,11.56 34.54,11.56 34.93,11.18 37.59,11.18 38.1,10.67 38.1,10.16 v38.61,9.65
  Bottom 0.203: v38.61,9.65 v46.74,9.78
  pour Top (no thermals): 46.61,7.87 61.98,7.87 61.98,0.76 46.61,0.76
PHASE_BS
  Top 0.203: Q15.2 6.73,53.09 8.38,53.09 8.51,53.21 10.67,53.21 11.68,52.2 C26.2 19.32,46.85 19.56,46.61 20.07,46.61 IC4.41
  pour Top (no thermals): 8.51,55.12 8.51,39.5 0.64,39.5 1.14,55.12
PHASE_CL  (via drill 0.6)
  Top 0.203: IC1.36 39.32,83.39 41.91,86.11 44.58,86.11 44.58,87.27 | 44.58,87.5 44.58,87.27 | 44.58,87.27 C22.2 44.69,87.76 44.45,88.14 v47.5,88.14 | v63.63,88.39 63.63,90.93
  Bottom 0.203: v47.5,88.14 48.26,88.9 63.12,88.9 v63.63,88.39
  pour Top (no thermals): 62.87,99.82 79.88,99.95 79.88,90.68 62.87,90.68
PHASE_CR  (via drill 0.6)
  Top 0.203: 29.46,6.73 v29.46,9.65 | IC3.36 30.1,16.75 30.1,15.24 29.97,15.11 29.97,13.46 v29.59,13.08 | C25.2 21.45,8.78 21.59,8.64 21.59,6.73
  Bottom 0.203: v29.59,13.08 29.08,12.57 29.08,10.03 v29.46,9.65
  pour Top (rank 2, no thermals): 16.76,7.49 18.54,7.49 19.3,6.73 30.23,6.73 30.23,7.37 32.39,7.37 32.39,0.76 16.76,0.38
PHASE_CS  (via drill 0.6)
  Top 0.203: 18.41,49.15 17.29,50.4 C27.2 15.73,50.42 v13.72,50.42 | 18.41,49.15 18.4,49.15 | Q18.3 3.68,68.07 2.79,67.18 2.79,62.87 4.57,61.09 4.7,61.09 5.33,61.09 v7.75,58.67 | IC4.36 18.47,49.1 18.41,49.15
  Bottom 0.203: v13.72,50.42 v13.72,52.45 12.19,52.45 10.41,54.23 10.41,55.37 9.65,56.13 8.76,56.13 7.75,57.15 v7.75,58.67
  pour Top (no thermals): 0.38,80.9 8,80.9 8,67.31 0.64,67.31
S_POT  (via drill 0.6)
  Top 0.203: S_POT.3 89.79,35.18 81.41,43.56 v81.41,46.1 | v64.52,57.4 64.52,58.7 U$3.A2
  Bottom 0.203: v81.41,46.1 80.01,46.1 75.18,50.93 72.14,50.93 71.12,50.93 70.74,51.31 70.36,51.69 67.44,51.69 67.18,51.94 65.91,51.94 64.64,53.21 64.64,57.28 v64.52,57.4
SN1L  (via drill 0.6)
  Top 0.203: IC1.33 40.82,83.74 42.04,84.96 v42.67,84.96 | R29.2 7.75,90.81 8.13,91.06 15.62,91.06 v16.26,90.3 | v22.86,90.55 22.86,88.27 v22.99,88.14
  Bottom 0.203: v42.67,84.96 42.55,84.96 41.4,86.36 25.27,86.36 v22.99,88.14 | v16.26,90.3 22.61,90.3 v22.86,90.55
  pour Top (no thermals): 3.81,89.92 3.81,92.08 4.19,92.58 4.19,95.25 4.83,95.89 5.46,95.89 6.35,95 6.48,92.33 8.13,91.19 8.13,90.42 7.62,89.92
SN1R  (via drill 0.6)
  Top 0.203: R32.2 v46.61,11.3 | IC3.33 28.7,16.6 28.7,16 28.19,15.49 v28.19,13.08
  Bottom 0.203: v46.61,11.3 33.4,11.18 33.27,11.18 33.15,11.3 32.13,11.3 31.37,12.06 31.37,13.08 30.48,13.97 30.23,13.97 28.57,13.97 28.19,13.59 v28.19,13.08
  pour Top (no thermals): 62.48,8.38 62.48,4.19 65.02,4.19 64.9,12.83 47.62,12.83 47.62,8.38
SN1S  (via drill 0.6)
  Top 0.203: R33.2 v10.16,63.25 | v19.05,52.07 19.05,51.82 20.07,50.55 20.15,50.55 IC4.33
  Bottom 0.203: v10.16,63.25 12.95,63.25 18.41,58.17 18.41,52.58 18.92,52.2 v19.05,52.07
  pour Top (no thermals): 3.68,66.8 12.07,66.8 12.07,64.26 3.68,64.26
SN2L  (via drill 0.6)
  Top 0.203: IC1.31 41.82,83.47 42.29,83.95 43.94,83.95 v44.83,84.84 | v36.2,88.9 34.28,88.9 R30.2
  Bottom 0.203: v44.83,84.84 43.05,86.74 41.02,88.9 v36.2,88.9
  pour Top (no thermals): 32.89,87.63 32.89,96.01 35.43,96.01 35.43,87.63
SN2R  (via drill 0.6)
  Top 0.203: IC3.31 27.65,16.09 v27.18,15.62 | v31.11,8.64 32.26,8.64 R31.2
  Bottom 0.203: v27.18,15.62 27.18,12.45 27.43,12.19 28.19,12.19 28.7,11.68 28.7,9.02 29.08,8.64 v31.11,8.64
  pour Top (no thermals): 32.13,7.75 32.89,7.75 32.89,4.06 35.05,4.06 35.05,10.92 32.13,10.92
SN2S  (via drill 0.6)
  Top 0.203: IC4.31 20.07,51.63 20.07,54.48 20.07,54.99 v20.32,55.24 | v15.37,44.45 13.34,44.45 12.83,43.94 12.83,43.69 12.57,43.43 11.3,43.43 10.41,42.55 R34.2
  Bottom 0.203: v15.37,44.45 15.75,44.58 22.1,51.82 22.1,55.24 v20.32,55.24
  pour Top (no thermals): 3.94,38.86 12.19,38.86 12.19,36.32 3.94,36.32
SO1L
  Top 0.203: R50.1 62.87,73.79 65.53,76.45 65.53,77.72 66.29,78.49 68.2,78.49 U$1.A0 74.56,72.12 C41.1
SO1R  (via drill 0.6)
  Top 0.102: 53.98,31.88 53.98,29.34
  Top 0.203: U$2.A0 67.94,42.04 60.96,42.04 60.45,41.53 60.45,39.88 59.82,39.24 58.55,39.24 58.42,39.12 v58.42,38.48 | 53.98,31.88 53.98,34.54 55.5,36.07 57.91,36.07 58.29,36.45 v58.42,36.58 | R52.1 49.76,29.12 C43.1 53.74,29.1 53.98,29.34
  Bottom 0.203: v58.42,36.58 v58.42,38.48
SO1S
  Top 0.203: U$3.A1 68.1,59.94 70.1,59.94 70.61,59.44 70.61,58.17 70.09,57.64 C39.1 R49.1
SO2L
  Top 0.203: U$1.A1 66.8,77.06 66.8,74.55 62.56,70.3 58.56,70.3 R47.1 58.42,70.45 C40.1
SO2R  (via drill 0.6)
  Top 0.203: C42.1 54.5,28.97 54.48,29.97 54.74,29.93 R51.1 55.08,30.48 55.08,32.35 55.03,32.35 54.48,32.89 54.48,34.42 55.63,35.56 59.05,35.56 59.69,36.2 v59.69,36.58 | U$2.A1 65.76,41.66 61.09,41.66 60.83,41.4 60.83,39.62 v59.69,38.48
  Bottom 0.203: v59.69,36.58 v59.69,38.48
SO2S
  Top 0.203: C38.1 64.28,52.98 64.64,53.34 | 64.64,53.34 65.41,54.1 68.07,54.1 69.72,55.75 69.72,58.55 U$3.A0 | R48.1 60.16,54.57 60.83,55.24 61.09,55.5 63.88,55.5 64.26,55.12 64.26,53.72 64.64,53.34
T_L  (via drill 0.6)
  Top 0.203: T_L.3 88.9,39.88 85.22,43.56 85.22,55.37 v84.71,55.88 | v61.72,60.45 61.72,61.85 U$1.2
  Bottom 0.203: v84.71,55.88 77.34,55.88 75.95,57.28 66.29,57.28 65.66,57.91 65.66,59.82 65.28,60.2 61.98,60.2 v61.72,60.45
T_R  (via drill 0.6)
  Top 0.203: U$2.2 61.85,24.77 61.85,24.26 62.48,23.62 64.64,23.62 65.02,23.24 65.02,21.59 v66.04,20.57 | T_R.3 94.87,20.95 v94.49,20.57
  Bottom 0.203: v66.04,20.57 92.84,20.57 v94.49,20.57
T_S  (via drill 0.6)
  Top 0.203: U$3.2 61.85,42.8 61.47,42.42 59.69,42.42 v59.31,42.04 | v80.9,27.3 88.52,27.3 T_S.3
  Bottom 0.203: v59.31,42.04 62.48,42.04 62.99,41.53 62.99,39.37 63.75,38.61 68.83,38.61 70.48,36.96 70.48,31.75 73.66,28.57 79.63,28.57 v80.9,27.3
VCC  (via drill 0.6)
  Top 0.203: 62.87,27.18 62.99,27.81 63.25,28.07 | C1.1 52.09,77.61 U$1.RAW | IC1.16 36.82,76.06 36.83,76.07 34.04,76.07 33.78,75.82 33.78,75.13 IC1.10 | R35.2 49.7,75.02 50.67,74.04 52.58,74.04 54.48,72.14 61.47,72.14 v61.98,71.63 | v65.28,70.48 66.04,70.48 66.42,70.87 | v30.86,36.96 30.86,36.58 | T_R.2 94.74,18.41 94.61,18.54 94.61,19.43 94.49,19.56 91.06,19.56 90.8,19.81 90.8,20.32
  Top 0.406: 64.52,37.21 64.01,36.45 63.88,36.32
  Bottom 0.203: v32.13,69.85 v28.19,69.85 | v61.98,71.63 64.13,71.63 v65.28,70.48 | v30.61,43.31 30.61,38.35 30.61,38.1 30.61,37.21 v30.86,36.96
  pour Top (rank 4, no thermals): 99.19,78.61 24.77,78.36 24.77,22.23 28.32,18.67 95.76,18.67 100.08,22.48 100.08,78.61
VDD  (via drill 0.6)
  Top 0.203: v21.08,53.47 21.08,52.69 IC4.29 | IC1.29 44.03,82.52 48.26,86.74 v49.66,86.74 | v19.23,53.85 v15.24,53.85 | IC3.29 24.86,17.18 24.26,17.78 16.13,17.78 v16,17.91
  Bottom 0.203: v19.23,53.85 20.7,53.85 v21.08,53.47 | Q3.3 49.15,91.06 49.28,90.93 49.28,90.81 48.51,91.57 48.51,91.82 48.39,92.33 48.39,97.79 49.02,98.81 79.5,98.81 81.79,96.52 C32.+ 81.15,86.74 v49.66,86.74 | v15.24,53.85 15.24,53.09 | v16,17.91 15.75,17.91
  pour Bottom (no thermals): 98.93,100.33 98.93,86.61 16.38,86.36 16.26,11.56 98.55,10.92 98.93,1.02 1.14,1.27 0.89,99.57
  pour Top (no thermals): 89.28,91.19 89.28,97.66 96.39,97.79 98.04,96.01 98.04,91.19